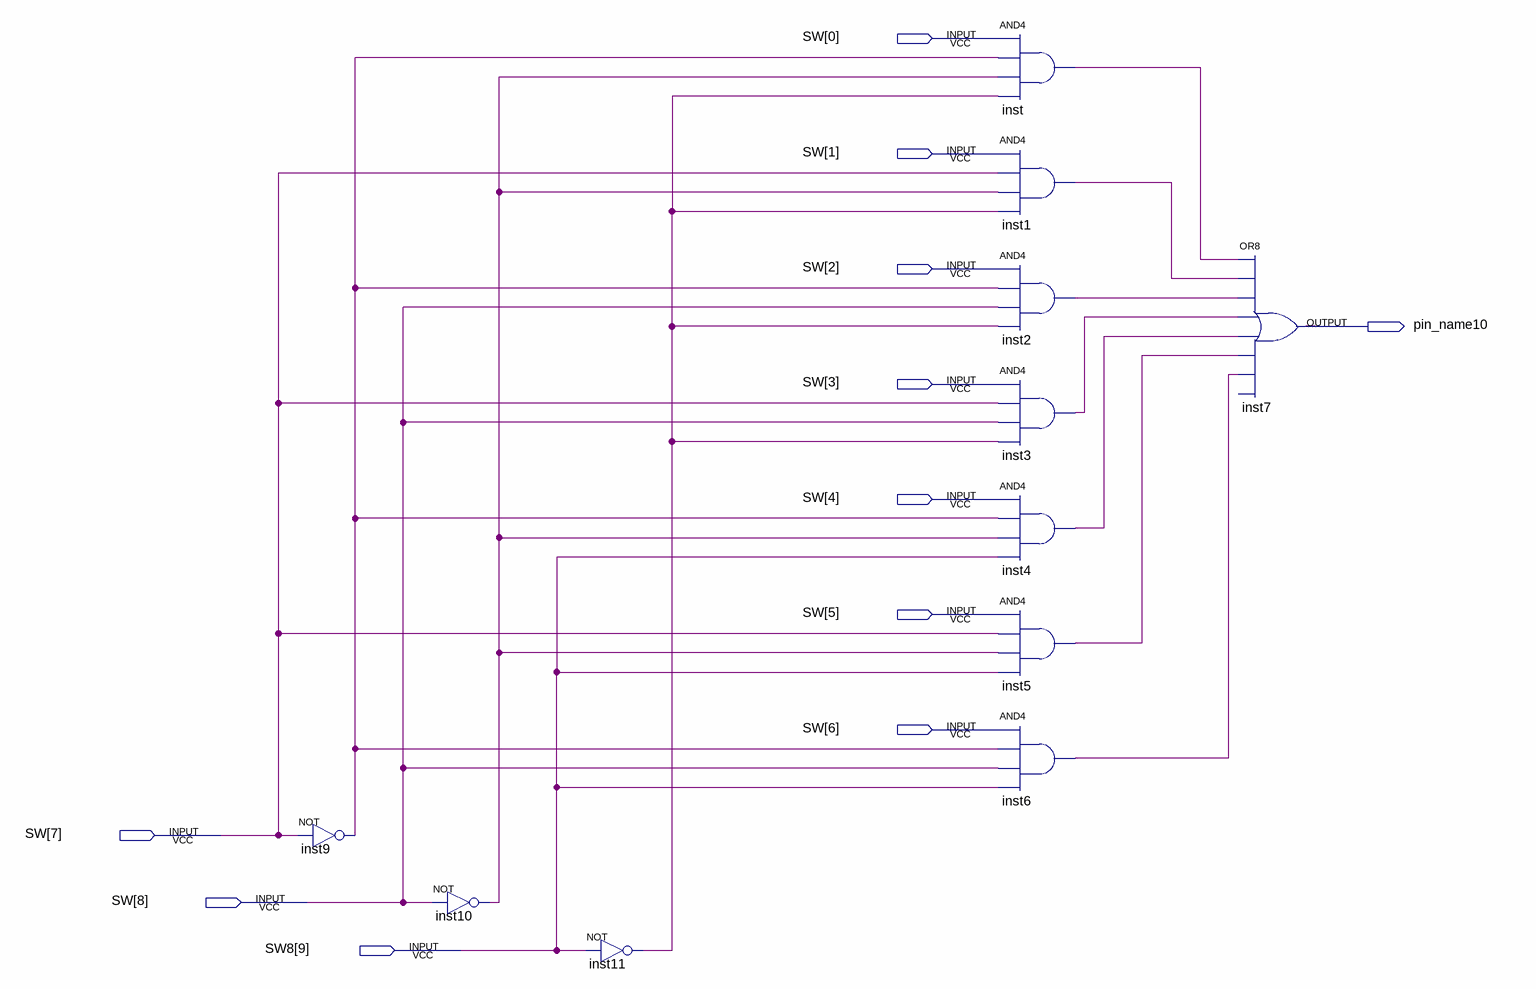
[diagram p0: schematic sheet]
// Quartus schematic part1-1.bdf as structural Verilog: 11 symbols, 11 pins
module \part1-1  (
  input  [8:0] SW,
  input  [9:9] SW8,
  output pin_name10
);

  wire inst1_out, inst2_out, inst3_out, inst4_out, inst5_out, inst6_out, inst9_out, inst10_out, inst11_out,
       inst_out;

  not inst9 (inst9_out, SW[7]);
  not inst10 (inst10_out, SW[8]);
  not inst11 (inst11_out, SW8[9]);
  and inst (inst_out, SW[0], inst9_out, inst10_out, inst11_out);
  and inst1 (inst1_out, SW[1], SW[7], inst10_out, inst11_out);
  and inst2 (inst2_out, SW[2], inst9_out, SW[8], inst11_out);
  and inst3 (inst3_out, SW[3], SW[7], SW[8], inst11_out);
  and inst4 (inst4_out, SW[4], inst9_out, inst10_out, SW8[9]);
  and inst5 (inst5_out, SW[5], SW[7], inst10_out, SW8[9]);
  and inst6 (inst6_out, SW[6], inst9_out, SW[8], SW8[9]);
  or inst7 (pin_name10, inst_out, inst1_out, inst2_out, inst3_out, inst4_out, inst5_out, inst6_out);  // open: IN8
endmodule
